# EAGLE design Charge switch (EAGLE 9.6.2)
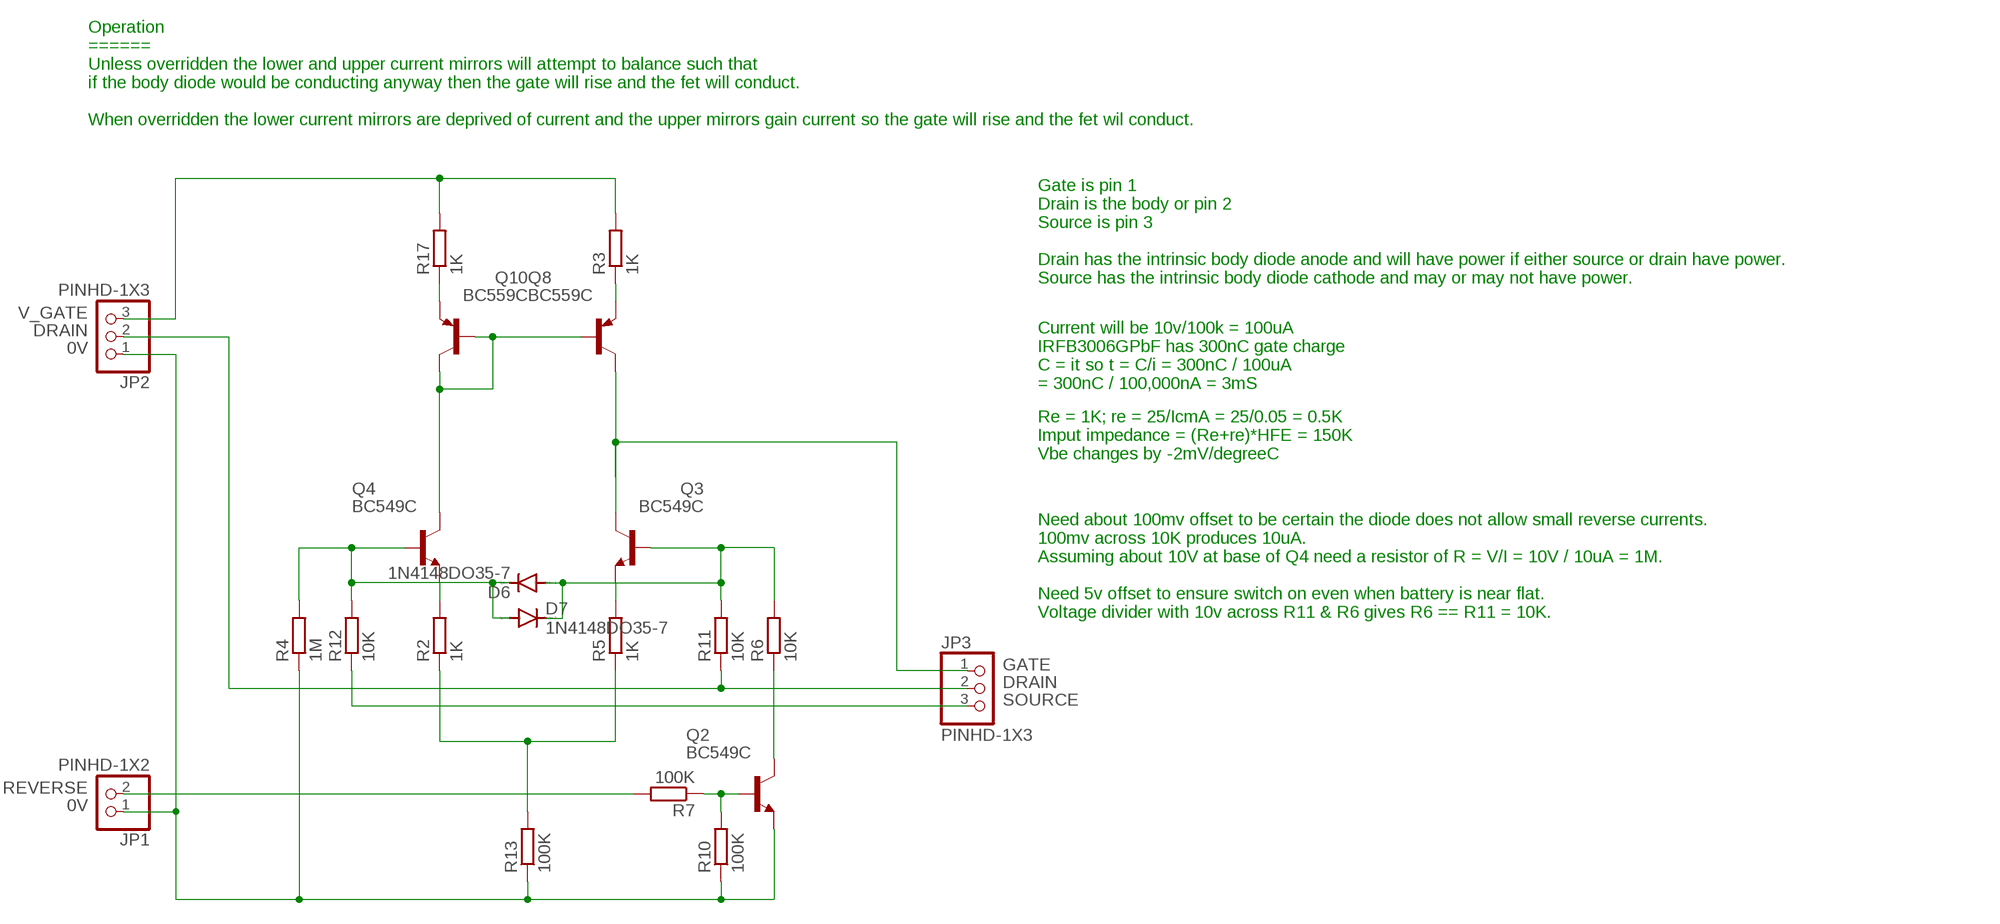
[diagram p0: schematic, sheet 1]

## Parts
D6  1N4148DO35-7  [DO35-7]
D7  1N4148DO35-7  [DO35-7]
JP1  PINHD-1X2  [1X02]
JP2  PINHD-1X3  [1X03]
JP3  PINHD-1X3  [1X03]
Q2  BC549C  [TO92-EBC]
Q3  BC549C  [TO92-EBC]
Q4  BC549C  [TO92-EBC]
Q8  BC559C  [TO92-EBC]
Q10  BC559C  [TO92-EBC]
R2  1K  R-EU_0204/7  [0204/7]
R3  1K  R-EU_0204/7  [0204/7]
R4  1M  R-EU_0204/7  [0204/7]
R5  1K  R-EU_0204/7  [0204/7]
R6  10K  R-EU_0204/7  [0204/7]
R7  100K  R-EU_0204/7  [0204/7]
R10  100K  R-EU_0204/7  [0204/7]
R11  10K  R-EU_0204/7  [0204/7]
R12  10K  R-EU_0204/7  [0204/7]
R13  100K  R-EU_0204/7  [0204/7]
R17  1K  R-EU_0204/7  [0204/7]

## Nets
0V: JP1.1 JP2.1 Q2.E R4.1 R10.1 R13.1
DRAIN: JP2.2 JP3.2 R11.1
GATE: JP3.1 Q3.C Q8.C
N$1: Q4.C Q8.B Q10.B Q10.C
N$4: R2.1 R5.1 R13.2
N$5: Q2.B R7.1 R10.2
N$6: D6.A D7.C Q3.B R6.2 R11.2
N$7: D6.C D7.A Q4.B R4.2 R12.2
N$8: Q4.E R2.2
N$10: Q2.C R6.1
N$11: Q3.E R5.2
N$19: Q10.E R17.1
N$20: Q8.E R3.1
REVERSE: JP1.2 R7.2
SOURCE: JP3.3 R12.1
V_GATE: JP2.3 R3.2 R17.2

## Notes on the sheet
- Operation
  ======
  Unless overridden the lower and upper current mirrors will attempt to balance such that
  if the body diode would be conducting anyway then the gate will rise and the fet will conduct.
  
  When overridden the lower current mirrors are deprived of current and the upper mirrors gain current so the gate will rise and the fet wil conduct.
- Gate is pin 1
  Drain is the body or pin 2
  Source is pin 3
  
  Drain has the intrinsic body diode anode and will have power if either source or drain have power.
  Source has the intrinsic body diode cathode and may or may not have power.
- Current will be 10v/100k = 100uA
  IRFB3006GPbF has 300nC gate charge
  C = it so t = C/i = 300nC / 100uA
  = 300nC / 100,000nA = 3mS
- Re = 1K; re = 25/IcmA = 25/0.05 = 0.5K
  Imput impedance = (Re+re)*HFE = 150K
  Vbe changes by -2mV/degreeC
- Need about 100mv offset to be certain the diode does not allow small reverse currents.
  100mv across 10K produces 10uA.
  Assuming about 10V at base of Q4 need a resistor of R = V/I = 10V / 10uA = 1M.
  
  Need 5v offset to ensure switch on even when battery is near flat.
  Voltage divider with 10v across R11 & R6 gives R6 == R11 = 10K.

## Library data of the parts
D6 D7 = diode:1N4148: DIODE high speed (Philips)
JP1 = Connector:PINHD-1X2: PIN HEADER; CATEGORY: CONNECTOR; SUB-CATEGORY: PIN-HEADER
JP2 JP3 = Connector:PINHD-1X3: PIN HEADER; CATEGORY: CONNECTOR; SUB-CATEGORY: PIN-HEADER
Q2-Q4 = transistor-npn:BC549*: NPN Transistor
Q8 Q10 = transistor-pnp:BC559*: PNP Transistror
R2-R7 R10-R13 R17 = resistor:R-EU_: RESISTOR, European symbol

## Board
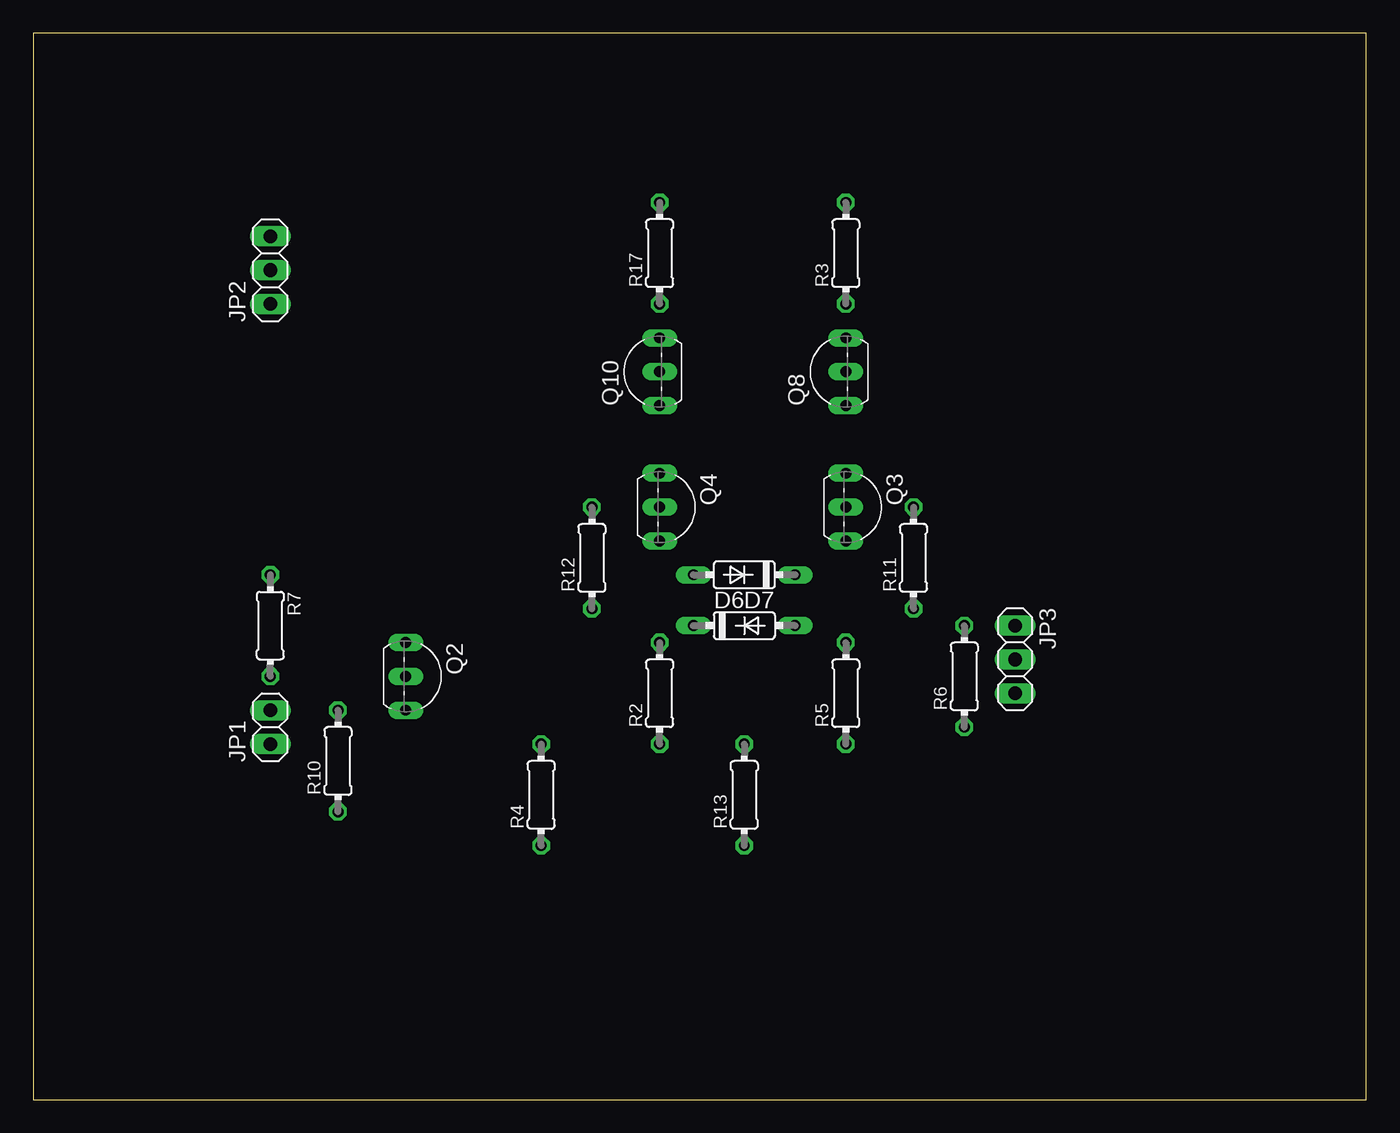
[diagram p1: board, top side]
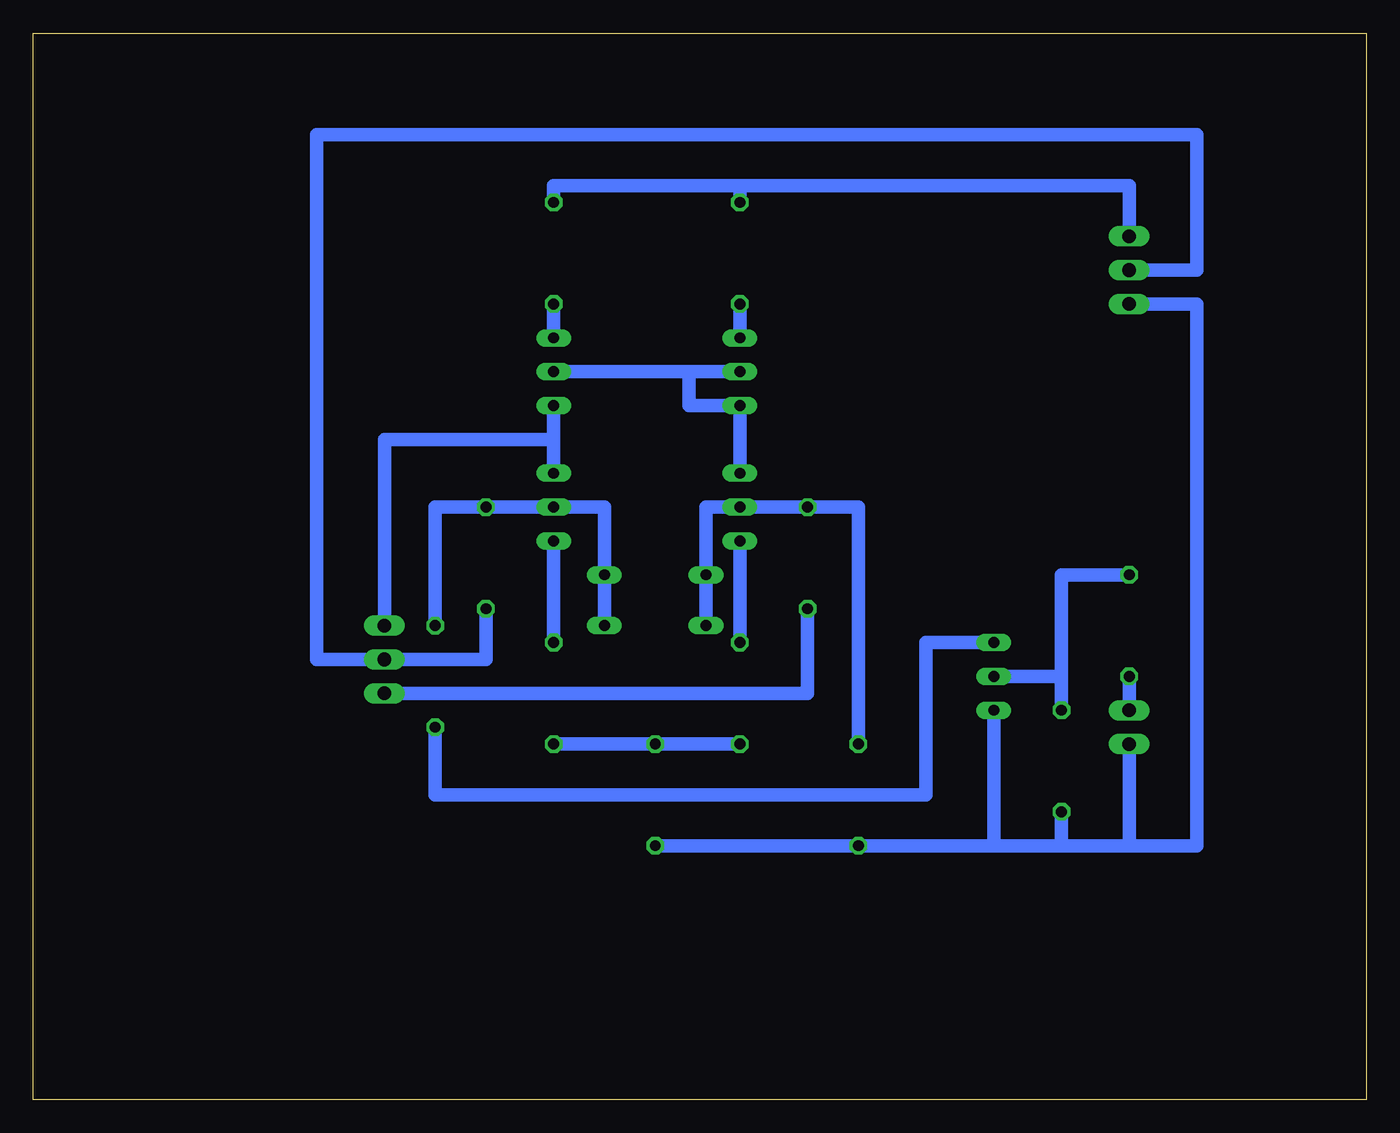
[diagram p2: board, bottom side, seen from below]

Size 100 x 80 mm. Coordinates in mm from the lower left corner, seen from the top.
Outline: 0,0 100,0 100,80 0,80 0,0
Copper layers (1*16): Top 0.035mm / dielectric 1.5mm / Bottom 0.035mm
Design rules "default": minimum track width 6mil, minimum drill 0.35mm, track to track 6mil, track to pad 6mil, pad to pad 6mil, via to via 6mil, smd to smd 6mil, copper to edge 40mil, drill to drill 6mil, minimum pad ring 10mil, minimum via ring 8mil, stop-mask expansion 4mil, vias tented up to drill 0mil, thermal gap 10mil

### Footprints (pad centres in the part's own frame; a part is rotated, then mirrored left to right if it is on the bottom)
DO35-7 = drill 0.813 long: A 3.81,0; C -3.81,0
1X02 = drill 1.016 long: 1 -1.27,0; 2 1.27,0
1X03 = drill 1.016 long: 1 -2.54,0; 2 0,0; 3 2.54,0
TO92-EBC = drill 0.813 long: B 0,-1.27; C -2.54,-1.27; E 2.54,-1.27
0204/7 = drill 0.813 octagon: 1 -3.81,0; 2 3.81,0

### Placement (x,y rotation side)
D6  53.34,35.56 0 top
D7  53.34,39.37 180 top
JP1  17.78,27.94 90 top
JP2  17.78,62.23 90 top
JP3  73.66,33.02 270 top
Q2  29.21,31.75 270 top
Q3  62.23,44.45 270 top
Q4  48.26,44.45 270 top
Q8  59.69,54.61 90 top
Q10  45.72,54.61 90 top
R2  46.99,30.48 90 top
R3  60.96,63.5 90 top
R4  38.1,22.86 90 top
R5  60.96,30.48 90 top
R6  69.85,31.75 90 top
R7  17.78,35.56 270 top
R10  22.86,25.4 90 top
R11  66.04,40.64 90 top
R12  41.91,40.64 90 top
R13  53.34,22.86 90 top
R17  46.99,63.5 90 top

### Tracks (layer width: path | path; a pad name or v marks a point on that pad's centre or on a via)
0V
  Bottom 1.016: JP1.1 17.78,19.05 | JP2.1 12.7,59.69 12.7,19.05 17.78,19.05 | R13.1 39.37,19.05 R4.1 27.94,19.05 | 27.94,19.05 22.86,19.05 | 22.86,19.05 17.78,19.05 | Q2.E 27.94,19.05 | R10.1 22.86,19.05
DRAIN
  Bottom 1.016: JP2.2 12.7,62.23 12.7,72.39 78.74,72.39 78.74,33.02 JP3.2 66.04,33.02 R11.1
GATE
  Bottom 1.016: Q8.C 60.96,49.53 | 60.96,49.53 Q3.C | 60.96,49.53 73.66,49.53 JP3.1
N$1
  Bottom 1.016: Q8.B 50.8,54.61 | 50.8,54.61 Q10.B | 50.8,54.61 50.8,52.07 Q10.C 46.99,49.53 Q4.C
N$4
  Bottom 1.016: R2.1 R13.2 R5.1
N$5
  Bottom 1.016: Q2.B 22.86,31.75 | 22.86,31.75 22.86,39.37 R7.1 | R10.2 22.86,31.75
N$6
  Bottom 1.016: R6.2 69.85,44.45 R11.2 Q3.B 57.15,44.45 D7.C D6.A
N$7
  Bottom 1.016: D6.C D7.A 49.53,44.45 Q4.B R12.2 38.1,44.45 R4.2
N$8
  Bottom 1.016: Q4.E R2.2
N$10
  Bottom 1.016: Q2.C 33.02,34.29 33.02,22.86 69.85,22.86 R6.1
N$11
  Bottom 1.016: Q3.E R5.2
N$19
  Bottom 1.016: R17.1 Q10.E
N$20
  Bottom 1.016: R3.1 Q8.E
REVERSE
  Bottom 1.016: JP1.2 R7.2
SOURCE
  Bottom 1.016: R12.1 41.91,30.48 JP3.3
V_GATE
  Bottom 1.016: 46.99,68.58 17.78,68.58 JP2.3 | R3.2 60.96,68.58 46.99,68.58 | R17.2 46.99,68.58